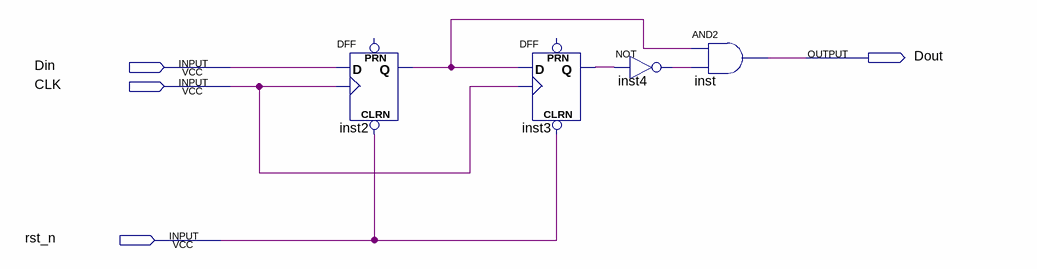
[diagram p0: schematic sheet]
// Quartus schematic trigger.bdf as structural Verilog: 4 symbols, 4 pins
module trigger (
  input  Din,
  input  CLK,
  input  rst_n,
  output Dout
);

  wire inst2_q, inst3_q, inst4_out;

  DFF inst2 (.CLRN(rst_n), .CLK(CLK), .D(Din), .Q(inst2_q));  // open: PRN
  DFF inst3 (.CLRN(rst_n), .CLK(CLK), .D(inst2_q), .Q(inst3_q));  // open: PRN
  not inst4 (inst4_out, inst3_q);
  and inst (Dout, inst2_q, inst4_out);
endmodule
